# Altium schematic sheet 1_Power.SchDoc
size 420 x 297 mm; SheetNumber: 1; SheetTotal: 3; Rozrobyv: Іванченко А.; Pereviryv: Адаменко Ю.; Zatverdyv: Адаменко Ю.; Oboznachennia: РІ91.468789.001 Е3; Naymenuvannya: Генератор прямого; Pershzastos: {Перш. застос.}; SpravNo: {Справ. №}; Naymenuvannya2: цифрового синтезу; MisceVudannya: НТУУ КПІ, РТФ, РІ-91; Naymenuvannya3: Схема електрична принципова
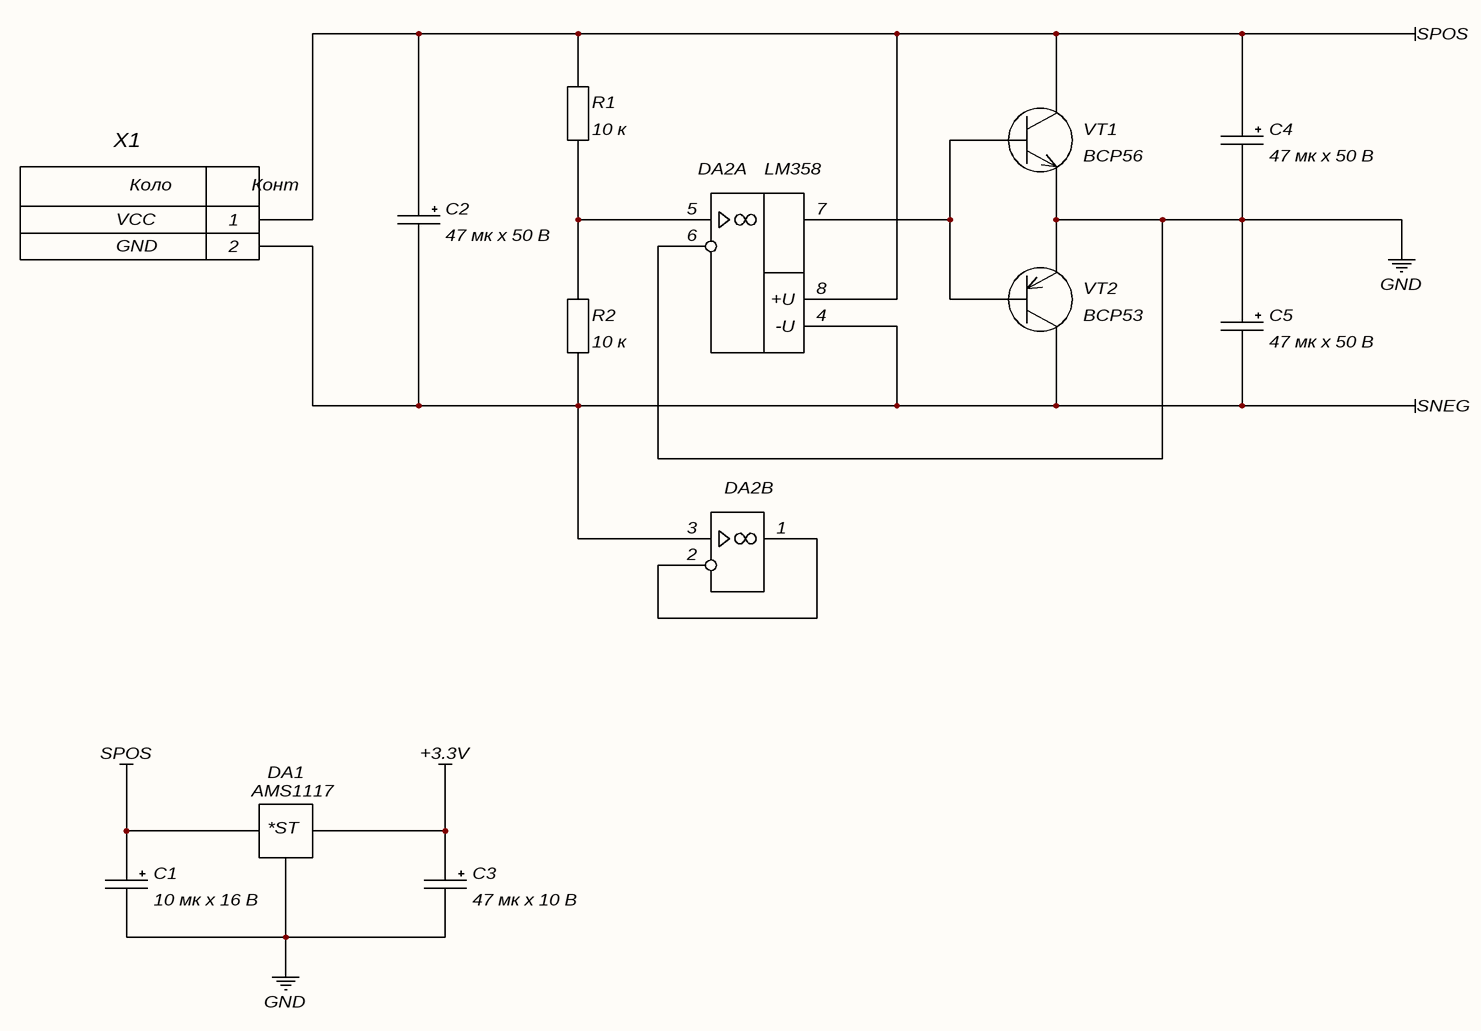
[diagram p0: 1_Power.SchDoc]

## Parts
C1  10 16: 10 мк х 16 В  [CAP: TANTAL-A]  (hidden comment: 10u 16V)
C2  47 50: 47 мк х 50 В  [CAP: SMD D6.3A6.6H7.7]  (hidden comment: 47u 50V)
C3  47 10: 47 мк х 10 В  [CAP: TANTAL-B]  (hidden comment: 47u 10V)
C4  47 50: 47 мк х 50 В  [CAP: SMD D6.3A6.6H7.7]  (hidden comment: 47u 50V)
C5  47 50: 47 мк х 50 В  [CAP: SMD D6.3A6.6H7.7]  (hidden comment: 47u 50V)
DA1  AMS1117  [SOT-223]
DA2  LM358  [8-SOIC]  (parts A,B of 2)
R1  10k  [RES: 0805]  (value not drawn)
R2  10k  [RES: 0805]  (value not drawn)
VT1  BCP56  [SOT-223]
VT2  BCP53  [SOT-223]
X1  PJ002  [CON: PJ002]  (value not drawn)

## Nets
+3.3V: C3.1 DA1.2(Vout)
GND: C1.2 C3.2 C4.2 C5.1 DA1.1(GND) DA2.6(-IN1) VT1.3(e) VT2.3(e)
SNEG: C2.2 C5.2 DA2.3(+IN2) DA2.4(-U) R2.1 VT2.2(k) X1.2
SPOS: C1.1 C2.1 C4.1 DA1.3(Vin) DA2.8(+U) R1.2 VT1.2(k) X1.1
NetDA2_1: DA2.1(OUT2) DA2.2(-IN2)
NetDA2_5: DA2.5(+IN1) R1.1 R2.2
NetDA2_7: DA2.7(OUT1) VT1.1(b) VT2.1(b)

## Notes on the sheet
- Перш. застос.
- Справ. №
- Зм.
- Лист
- № докум.
- Підпис
- Дата
- Літ.
- Маса
- Масштаб
- Т. контр.
- Розроб.
- Перев.
- Листів
- Н. контр.
- Затв.
- Копіював:
- Формат А3
- (in symbol AMS1117) *ST
- (in symbol DC Jack) Коло; Конт; VCC; GND

## Library data of the parts
C1 = Capacitor_polar: Polarity; 470 6,3: 470 мк х 6,3 В; 2200 35: 2200 мк x 35 В; 100 16: 100 мк х 16 В; 0.1 400: 0,1 мк х 400 В; 2.2 16: 2,2 мк х 16 В; 1 16: 1 мк х 16 В; 47 50: 47 мк х 50 В; 47 10: 47 мк х 10 В
C2 C4 C5 = Capacitor_polar: Polarity; 470 6,3: 470 мк х 6,3 В; 2200 35: 2200 мк x 35 В; 100 16: 100 мк х 16 В; 0.1 400: 0,1 мк х 400 В; 10 16: 10 мк х 16 В; 2.2 16: 2,2 мк х 16 В; 1 16: 1 мк х 16 В; 47 10: 47 мк х 10 В
C3 = Capacitor_polar: Polarity; 470 6,3: 470 мк х 6,3 В; 2200 35: 2200 мк x 35 В; 100 16: 100 мк х 16 В; 0.1 400: 0,1 мк х 400 В; 10 16: 10 мк х 16 В; 2.2 16: 2,2 мк х 16 В; 1 16: 1 мк х 16 В; 47 50: 47 мк х 50 В
DA1 = AMS1117: 3.3V Voltage; pin to pad: 2>4; Model: AMS1117
DA2 = Op Amp: ComponentLink1Description: Datasheet; ComponentLink1URL: https://www.analog.com/media/en/technical-documentation/data-sheets/AD8065_8066.pdf; LM358: LM358; AD8066: AD8066
R1 R2 = Resistor: 220: 220; 1 к: 1 к; 3,3 к: 3,3 к; 9,1 к: 9,1 к; 200: 200; 50: 50; 510 к: 510 к; 10 к: 10 к; 0: 0
VT1 = Transistor NPN: pin to pad: 2>2+4; Model: BCP56
VT2 = Transistor PNP: pin to pad: 2>2+4; Model: BCP53
X1 = DC Jack: pin to pad: 2>2+3